# EAGLE schematic dimitar-schematic (EAGLE 7.1.0)
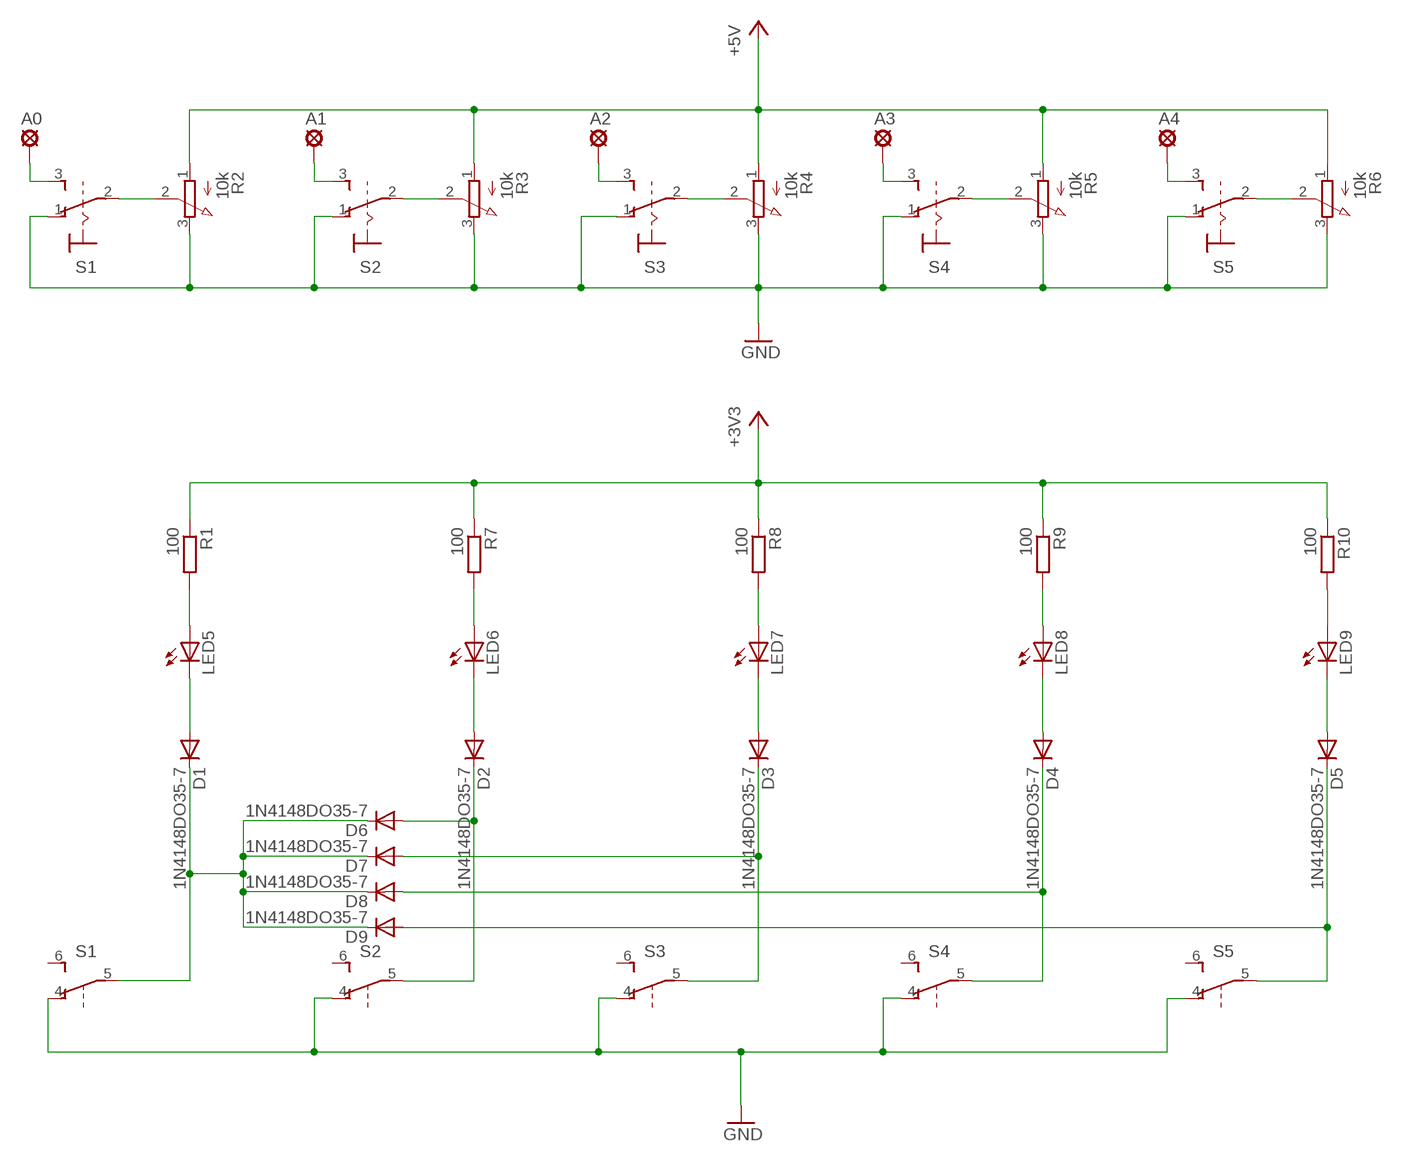
[diagram p0: schematic, sheet 1]

## Parts
A0  SE14  [SE14]
A1  SE14  [SE14]
A2  SE14  [SE14]
A3  SE14  [SE14]
A4  SE14  [SE14]
D1  1N4148DO35-7  [DO35-7]
D2  1N4148DO35-7  [DO35-7]
D3  1N4148DO35-7  [DO35-7]
D4  1N4148DO35-7  [DO35-7]
D5  1N4148DO35-7  [DO35-7]
D6  1N4148DO35-7  [DO35-7]
D7  1N4148DO35-7  [DO35-7]
D8  1N4148DO35-7  [DO35-7]
D9  1N4148DO35-7  [DO35-7]
LED5  LED5MM  [LED5MM]
LED6  LED5MM  [LED5MM]
LED7  LED5MM  [LED5MM]
LED8  LED5MM  [LED5MM]
LED9  LED5MM  [LED5MM]
R1  100  R0207/10  [0207/10]
R2  10k  3RP/1610N  [3RP/1610N]
R3  10k  3RP/1610N  [3RP/1610N]
R4  10k  3RP/1610N  [3RP/1610N]
R5  10k  3RP/1610N  [3RP/1610N]
R6  10k  3RP/1610N  [3RP/1610N]
R7  100  R0207/10  [0207/10]
R8  100  R0207/10  [0207/10]
R9  100  R0207/10  [0207/10]
R10  100  R0207/10  [0207/10]
S1  320-938  [320-938]
S2  320-938  [320-938]
S3  320-938  [320-938]
S4  320-938  [320-938]
S5  320-938  [320-938]

## Nets
+3V3: R1.1 R7.1 R8.1 R9.1 R10.1
+5V: R2.1(A) R3.1(A) R4.1(A) R5.1(A) R6.1(A)
GND: R2.3(E) R3.3(E) R4.3(E) R5.3(E) R6.3(E) S1.1(1:O) S1.4(B:O) S2.1(1:O) S2.4(B:O) S3.1(1:O) S3.4(B:O) S4.1(1:O) S4.4(B:O) S5.1(1:O) S5.4(B:O)
N$1: R2.2(S) S1.2(1:P)
N$2: R3.2(S) S2.2(1:P)
N$3: R4.2(S) S3.2(1:P)
N$4: R5.2(S) S4.2(1:P)
N$5: R6.2(S) S5.2(1:P)
N$6: D1.A LED5.K(C)
N$7: A0.MP S1.3(1:S)
N$8: A1.MP S2.3(1:S)
N$9: A2.MP S3.3(1:S)
N$10: A3.MP S4.3(1:S)
N$11: A4.MP S5.3(1:S)
N$12: LED5.A R1.2
N$13: LED6.A R7.2
N$14: LED7.A R8.2
N$15: LED8.A R9.2
N$16: LED9.A R10.2
N$17: D2.A LED6.K(C)
N$18: D3.A LED7.K(C)
N$19: D4.A LED8.K(C)
N$20: D5.A LED9.K(C)
N$22: D2.C D6.A S2.5(B:P)
N$23: D3.C D7.A S3.5(B:P)
N$24: D4.C D8.A S4.5(B:P)
N$25: D5.C S5.5(B:P)
N$27: D1.C D6.C D7.C D8.C D9.C S1.5(B:P)
Unconnected: D9.A S1.6(B:S) S2.6(B:S) S3.6(B:S) S4.6(B:S) S5.6(B:S)

## Library data of the parts
A0 A1-A4 = solpad:SE14: SOLDER PAD E1553, drill 1,4mm, distributor Buerklin, 07F820
D1-D9 = diode:1N4148: DIODE high speed (Philips)
LED5-LED9 = led:LED: LED OSRAM: - CHIPLED LG R971, LG N971, LY N971, LG Q971, LY Q971, LO R971, LY R971 LH N974, LH R974 LS Q976, LO Q976, LY Q976 LO Q996 - Hyper CHIPLED LW Q18S LB Q993, LB Q99A, LB R99A - SideLED LS A670, LO A670, LY A670, LG A670, LP A670 LB A673, LV A673, LT A673, LW A673 LH A674 LY A675 LS A676, LA A676, LO A676, LY A676, LW A676 LS A679, LY A679, LG A679 - Hyper Micro SIDELED® LS Y876, LA Y876, LO Y876, LY Y876 LT Y87S - SmartLED LW L88C, LW L88S LB L89C, LB L89S, LG L890 LS L89K, LO L89K, LY L89K LS L896, LA L896, LO L896, LY L896 - TOPLED LS T670, LO T670, LY T670, LG T670, LP T670 LSG T670, LSP T670, LSY T670, LOP T670, LYG T670 LG T671, LOG T671, LSG T671 LB T673, LV T673, LT T673, LW T673 LH T674 LS T676, LA T676, LO T676, LY T676, LB T676, LH T676, LSB T676, LW T676 LB T67C, LV T67C, LT T67C, LS T67K, LO T67K, LY T67K, LW E67C LS E67B, LA E67B, LO E67B, LY E67B, LB E67C, LV E67C, LT E67C LW T67C LS T679, LY T679, LG T679 LS T770, LO T770, LY T770, LG T770, LP T770 LB T773, LV T773, LT T773, LW T773 LH T774 LS E675, LA E675, LY E675, LS T675 LS T776, LA T776, LO T776, LY T776, LB T776 LHGB T686 LT T68C, LB T68C - Hyper Mini TOPLED® LB M676 - Mini TOPLED Santana® LG M470 LS M47K, LO M47K, LY M47K Source: http://www.osram.convergy.de LUXEON: - LUMILED® LXK2-PW12-R00, LXK2-PW12-S00, LXK2-PW14-U00, LXK2-PW14-V00 LXK2-PM12-R00, LXK2-PM12-S00, LXK2-PM14-U00 LXK2-PE12-Q00, LXK2-PE12-R00, LXK2-PE12-S00, LXK2-PE14-T00, LXK2-PE14-U00 LXK2-PB12-K00, LXK2-PB12-L00, LXK2-PB12-M00, LXK2-PB14-N00, LXK2-PB14-P00, LXK2-PB14-Q00 LXK2-PR12-L00, LXK2-PR12-M00, LXK2-PR14-Q00, LXK2-PR14-R00 LXK2-PD12-Q00, LXK2-PD12-R00, LXK2-PD12-S00 LXK2-PH12-R00, LXK2-PH12-S00 LXK2-PL12-P00, LXK2-PL12-Q00, LXK2-PL12-R00 Source: www.luxeon.com KINGBRIGHT: KA-3528ASYC Source: www.kingbright.com
R1 R7-R10 = eagle-ltspice:R: RESISTOR, European symbol; SPICEMODEL: NONE; SPICEPREFIX: R
R2-R6 = pot:3RP/1610N: 16mm Potentiometer one level Source: http://www.alphapotentiometers.net/html/16mm_pot_2.html
S1-S5 = switch:320-938: TOGGLE SWITCH distributor RS Components